# Altium schematic sheet SHDN-CURRENT-S14-V00-Connector.SchDoc: External Connector Interface
size A3; DrawnBy: Jonn Dillon; DocumentNumber: 14; SheetNumber: 14; SheetTotal: 14; Project: Shutdown Current Board 2020
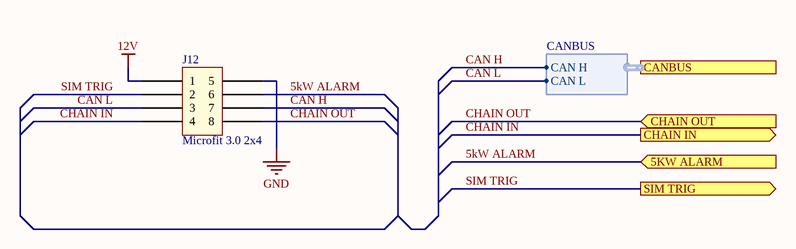
[diagram p0: SHDN-CURRENT-S14-V00-Connector.SchDoc]

## Parts
J12  Microfit 3.0 2x4  [Microfit_2X4_R_TH]

## Ports
5KW ALARM (in), CANBUS (harness CANBUS), CHAIN IN (out), CHAIN OUT (in), SIM TRIG (out)

## Harnesses
CANBUS: CAN H, CAN L

## Nets
12V: J12.1
GND: J12.5
5kW ALARM: J12.6 ; port 5KW ALARM
CAN H: J12.7 ; port CANBUS.CAN H
CAN L: J12.3 ; port CANBUS.CAN L
CHAIN IN: J12.4 ; port CHAIN IN
CHAIN OUT: J12.8 ; port CHAIN OUT
SIM TRIG: J12.2 ; port SIM TRIG

## Notes on the sheet
- Revision History:
- Sheet Title:
- Rev
- Date
- Description
- Project:
- Size:
- Drawn By:
- A3
- Number:
- Revision:
- Sheet
- Version:
- of
- QUT Motorsport
- O-120, Gardens Point
- 2 George Street
- Brisbane, QLD 4000
- Australia
- Print Date:
- Print Time:
- File Name:

## Library data of the parts
J12 = Microfit_2x4